# EAGLE design scheda_progetto_ver_4.2 (EAGLE 9.6.2)
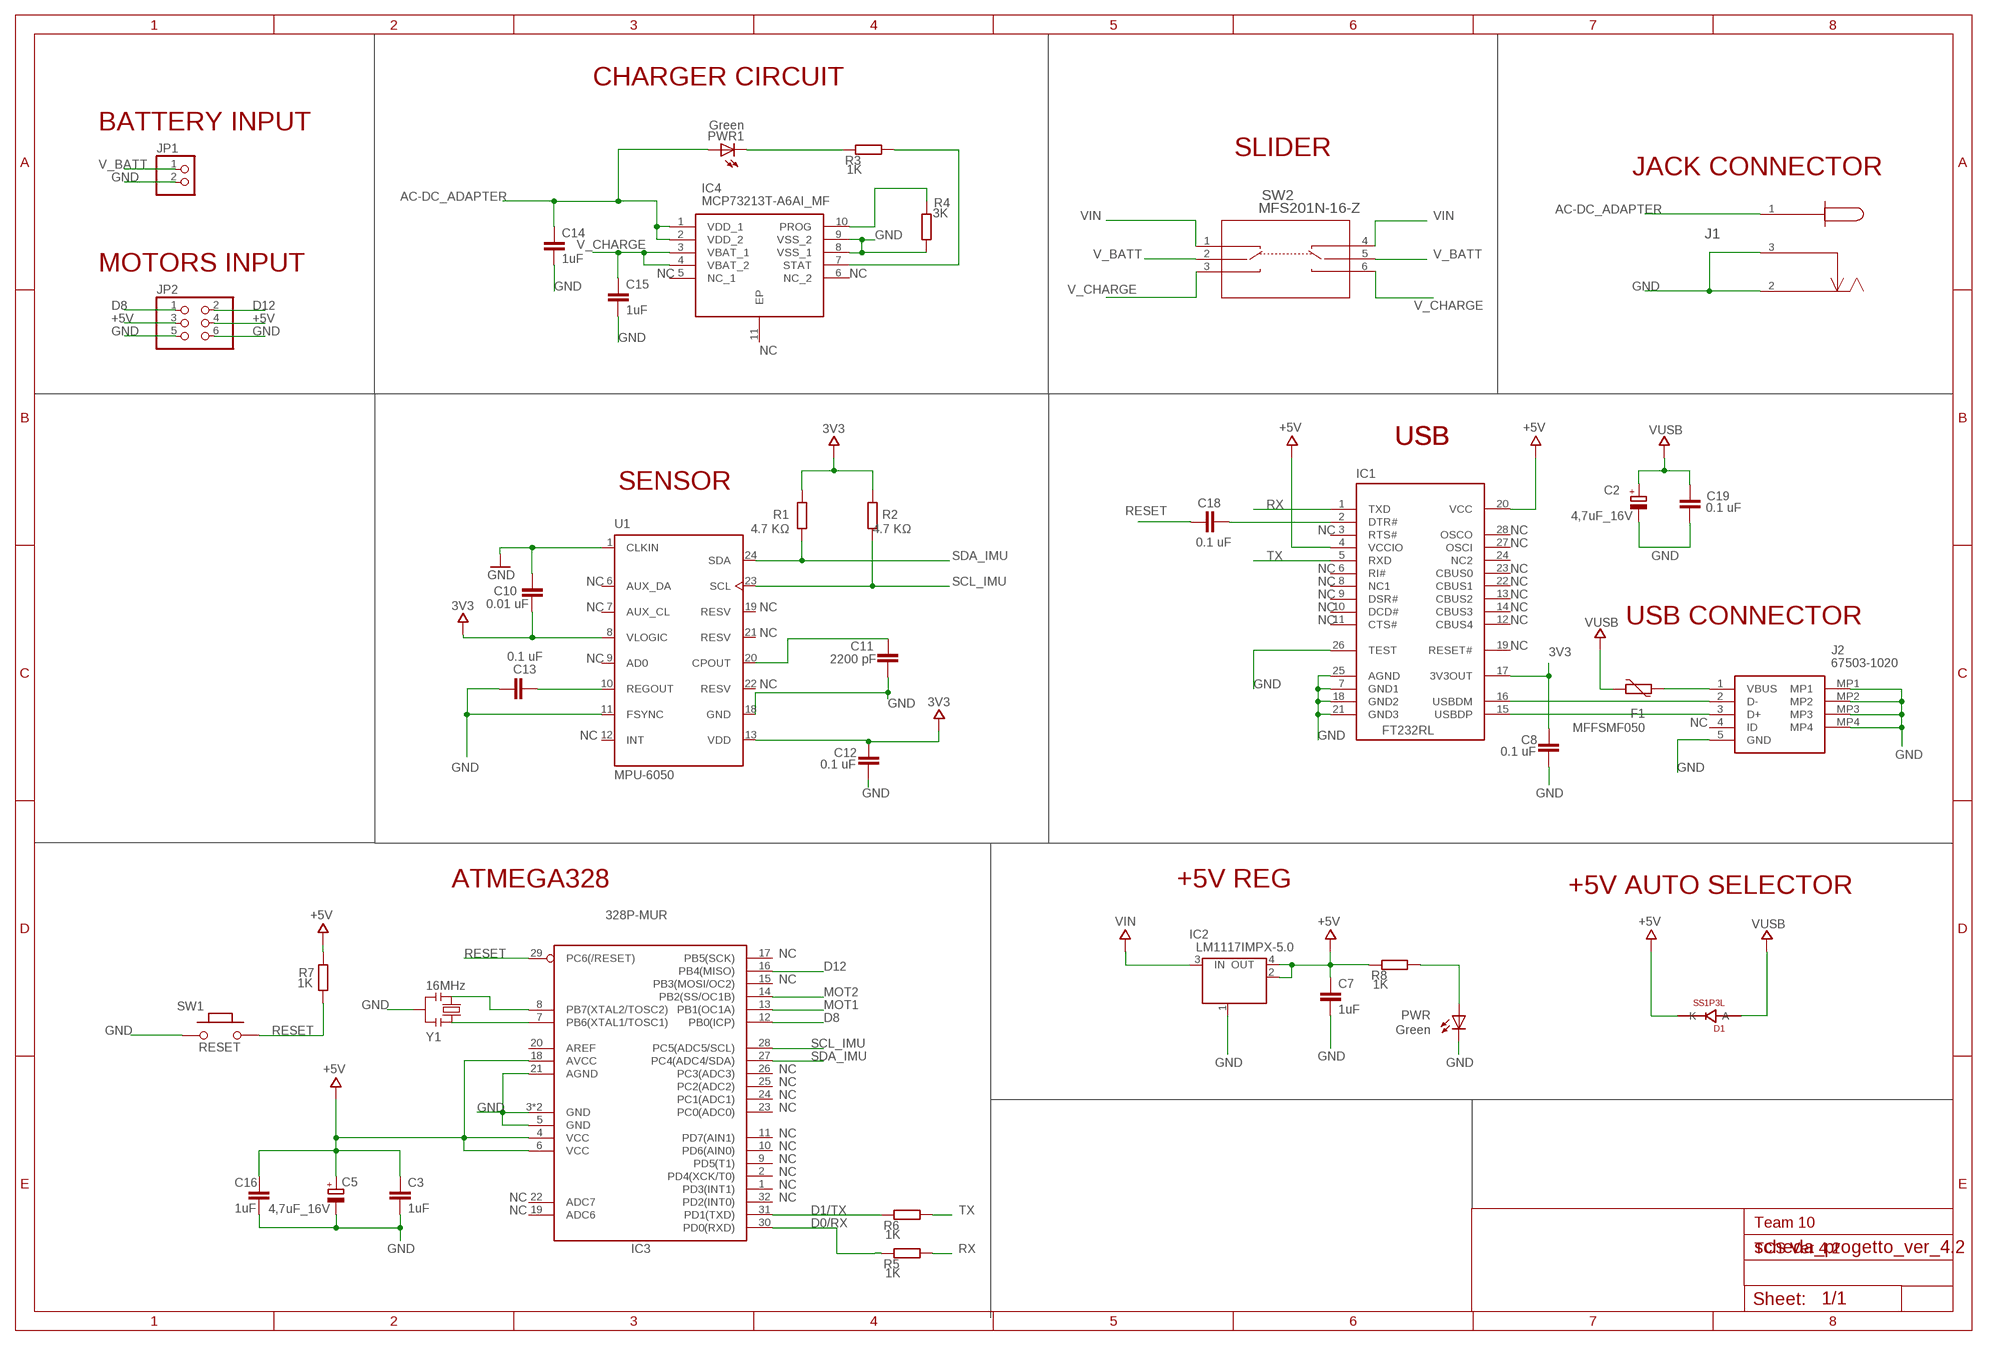
[diagram p0: schematic, sheet 1]

## Parts
C2  4,7uF_16V  0833_TAJA475MO16RNJ  [TAN-A]
C3  1uF  C-EUC0603  [C0603]
C5  4,7uF_16V  0833_TAJA475MO16RNJ  [TAN-A]
C7  1uF  C-EUC0603  [C0603]
C8  0.1 uF  C-EUC0603  [C0603]
C10  0.01 uF  C-EUC0603  [C0603]
C11  2200 pF  C-EUC0603  [C0603]
C12  0.1 uF  C-EUC0603  [C0603]
C13  0.1 uF  C-EUC0603  [C0603]
C14  1uF  C-EUC0603  [C0603]
C15  1uF  C-EUC0603  [C0603]
C16  1uF  C-EUC0603  [C0603]
C18  0.1 uF  C-EUC0603  [C0603]
C19  0.1 uF  C-EUC0603  [C0603]
D1  SS1P3L  0025_SS1P3L-M3/84A  [DO220AAL]
F1  MFFSMF050  PTC  [0603-1608X90N]
IC1  FT232RL  0226_FT232RL  [SSOP28]
IC2  LM1117IMPX-5.0  0022_LM1117IMPX-5.0  [LINEAR_SOT223]
IC3  328P-MUR  ATMEGA328P-32MUR  [VQFN32]
IC4  MCP73213T-A6AI_MF  [SON50P300X300X100-11N]
J1  694106105102  [CONN3_06105102_WRE]
J2  67503-1020  [675031020]
JP1  PINHD-1X2  [1X02]
JP2  PINHD-2X3  [2X03]
PWR  Green  0043_KPT-2012SGC  [CHIPLED_0805]
PWR1  Green  0043_KPT-2012SGC  [CHIPLED_0805]
R1  4.7 KΩ  R-EU_R0603  [R0603]
R2  4.7 KΩ  R-EU_R0603  [R0603]
R3  1K  R-EU_R0603  [R0603]
R4  3K  R-EU_R0603  [R0603]
R5  1K  R-EU_R0603  [R0603]
R6  1K  R-EU_R0603  [R0603]
R7  1K  R-EU_R0603  [R0603]
R8  1K  R-EU_R0603  [R0603]
SW1  RESET  0173_IT-1185AP1C-160G-G_T&R  [SMD_157SW]
SW2  MFS201N-16-Z  [MFS201N-16-Z_NDC]
U1  MPU-6050  [QFN50P400X400X95-24N]
Y1  16MHz  0011_CSTCE16M0V53-R0  [RESONATOR]

## Nets
3V3: C8.2 C10.1 C12.2 IC1.17(3V3OUT) R1.2 R2.2 U1.8(VLOGIC) U1.13(VDD)
+5V: C3.1 C5.1(+) C7.1 C16.1 D1.P$1(K) IC1.4(VCCIO) IC1.20(VCC) IC2.2(OUT) IC2.4(OUT) IC3.4(VCC) IC3.6(VCC) IC3.18(AVCC) JP2.3 JP2.4 R7.2 R8.1
AC-DC_ADAPTER: C14.1 IC4.1(VDD_1) IC4.2(VDD_2) J1.1 PWR1.A
D0/RX: IC3.30(PD0(RXD)) R5.1
D1/TX: IC3.31(PD1(TXD)) R6.1
D8: IC3.12(PB0(ICP)) JP2.1
D12: IC3.16(PB4(MISO)) JP2.2
GND: C2.2(-) C3.2 C5.2(-) C7.2 C8.1 C10.2 C11.1 C12.1 C13.2 C14.2 C15.2 C16.2 C19.1 IC1.7(GND1) IC1.18(GND2) IC1.21(GND3) IC1.25(AGND) IC1.26(TEST) IC2.1(GND/ADJ) IC3.3(GND) IC3.5(GND) IC3.21(AGND) IC3.33(GND) IC4.8(VSS_1) IC4.9(VSS_2) J1.2 J1.3 J2.5(GND) J2.MP1 J2.MP2 J2.MP3 J2.MP4 JP1.2 JP2.5 JP2.6 PWR.C R4.2 SW1.1 U1.1(CLKIN) U1.11(FSYNC) U1.18(GND) Y1.2
MOT1: IC3.13(PB1(OC1A))
MOT2: IC3.14(PB2(SS/OC1B))
N$1: IC3.8(PB7(XTAL2/TOSC2)) Y1.3
N$2: IC3.7(PB6(XTAL1/TOSC1)) Y1.1
N$3: PWR.A R8.2
N$4: C18.1 IC1.2(DTR#)
N$5: IC1.15(USBDP) J2.3(D+)
N$6: IC1.16(USBDM) J2.2(D-)
N$7: C11.2 U1.20(CPOUT)
N$8: IC4.10(PROG) R4.1
N$9: PWR1.C R3.1
N$10: IC4.7(STAT) R3.2
N$12: C13.1 U1.10(REGOUT)
N$19: F1.2 J2.1(VBUS)
RESET: C18.2 IC3.29(PC6(/RESET)) R7.1 SW1.2
RX: IC1.1(TXD) R5.2
SCL_IMU: IC3.28(PC5(ADC5/SCL)) R2.1 U1.23(SCL)
SDA_IMU: IC3.27(PC4(ADC4/SDA)) R1.1 U1.24(SDA)
TX: IC1.5(RXD) R6.2
V_BATT: JP1.1 SW2.2 SW2.5
V_CHARGE: C15.1 IC4.3(VBAT_1) IC4.4(VBAT_2) SW2.3 SW2.6
VIN: IC2.3(IN) SW2.1 SW2.4
VUSB: C2.1(+) C19.2 D1.P$2(A) F1.1
Unconnected: IC1.3(RTS#) IC1.6(RI#) IC1.8(NC1) IC1.9(DSR#) IC1.10(DCD#) IC1.11(CTS#) IC1.12(CBUS4) IC1.13(CBUS2) IC1.14(CBUS3) IC1.19(RESET#) IC1.22(CBUS1) IC1.23(CBUS0) IC1.24(NC2) IC1.27(OSCI) IC1.28(OSCO) IC3.1(PD3(INT1)) IC3.2(PD4(XCK/T0)) IC3.9(PD5(T1)) IC3.10(PD6(AIN0)) IC3.11(PD7(AIN1)) IC3.15(PB3(MOSI/OC2)) IC3.17(PB5(SCK)) IC3.19(ADC6) IC3.20(AREF) IC3.22(ADC7) IC3.23(PC0(ADC0)) IC3.24(PC1(ADC1)) IC3.25(PC2(ADC2)) IC3.26(PC3(ADC3)) IC3.32(PD2(INT0)) IC4.5(NC_1) IC4.6(NC_2) IC4.11(EP) J2.4(ID) U1.6(AUX_DA) U1.7(AUX_CL) U1.9(AD0) U1.12(INT) U1.19(RESV) U1.21(RESV) U1.22(RESV)

## Notes on the sheet
- CHARGER CIRCUIT
- BATTERY INPUT
- SLIDER
- JACK CONNECTOR
- MOTORS INPUT
- NC | NC
- NC
- USB | USB | USB
- SENSOR
- NC | NC
- NC
- NC | NC
- NC | NC | NC
- NC | NC
- NC | NC | NC | NC
- NC | NC | USB CONNECTOR
- NC
- NC
- NC
- NC
- NC
- NC
- ATMEGA328 | +5V REG | +5V AUTO SELECTOR
- NC
- NC
- NC
- NC
- NC
- NC
- NC
- NC
- NC
- NC
- NC
- NC | NC
- NC
- Team 10
- TCS Ver 4.2

## Library data of the parts
C2 C5 = Condensatori:0833_TAJA475MO16RNJ: 4,7uF; CASE: Case_A_(1206); MF: KYOCERA AVX; MONTHLY_USAGE: _____; MPN: TAJA475M016RNJ; OC_FARNELL: 2333019; PART_NUMBER: TAJA475MO16RNJ; PRICE: _____; SUPPLIER: _____; TYPE: Condensatori
C3 C7 C14-C16 = rcl:C-EU: CAPACITOR, European symbol; MF: KYOCERA AVX; MPN: 0603YC105KAT4A; OC_FARNELL: 3340859; SPICEPREFIX: C
C8 C12 C13 C18 C19 = rcl:C-EU: CAPACITOR, European symbol; MF: KEMET; MPN: C0603C104K3RECTU; OC_FARNELL: 2904649; SPICEPREFIX: C
C10 = rcl:C-EU: CAPACITOR, European symbol; MF: MURATA; MPN: GRM1885C1H103JA01D; OC_FARNELL: 2456107; SPICEPREFIX: C
C11 = rcl:C-EU: CAPACITOR, European symbol; MF: WURTH ELEKTRONIK; MPN: 885012206061; OC_FARNELL: 2534028; SPICEPREFIX: C
D1 = Diodi:0025_SS1P3L-M3/84A: 1A 30V Schottky Barrier Rectifiers -SS1P3L-M3/84A; CASE: SMP; MF: VISHAY; MONTHLY_USAGE: _____; MPN: SS1P3L-M3/84A; OC_FARNELL: 2889242; PART_NUMBER: SS1P3L-M3/84A; PRICE: _____; SUPPLIER: _____; TYPE: Diodi
F1 = Arduino-rcl:PTC: SMD PTC; DATASHEET: http://www.bourns.com/docs/Product-Datasheets/mffsmf.pdf; DISTRIBUTOR-LINK: http://www.digikey.com/product-detail/en/bourns-inc/MF-FSMF050X-2/MF-FSMF050X-2CT-ND/2039389; DISTRIBUTOR-PN: MF-FSMF050X-2CT-ND; MANUFACTURER: Bourns Inc; MANUFACTURER-PN: MF-FSMF050X-2; MF: BOURNS; MPN: MF-FSMF050X-2; OC_FARNELL: 1717227
IC1 = IntegratedCircuits:0226_FT232RL: USB to serial UART interface -FT232RL; CASE: SSOP28; MONTHLY_USAGE: _____; OC_FARNELL: unknown; PART_NUMBER: FT232RL; PRICE: _____; SUPPLIER: _____; TYPE: Circuito_Integrato
IC2 = IntegratedCircuits:0022_LM1117IMPX-5.0: Low-dropout linear regulator 5V -LM1117IMPX-5.0; CASE: SOT223; MONTHLY_USAGE: _____; OC_FARNELL: unknown; PART_NUMBER: LM1117IMPX-5.0; PRICE: _____; SUPPLIER: _____; TYPE: Circuito_Integrato
IC3 = Arduino-ucs&SoCs:ATMEGA328P-32: 8-bit Microcontroller with 32KBytes In-System Programmable Flash ATMEGA328P-AU; DATASHEET: http://www.atmel.com/images/Atmel-8271-8-bit-AVR-Microcontroller-ATmega48A-48PA-88A-88PA-168A-168PA-328-328P_datasheet_Complete.pdf; DISTRIBUTOR-LINK: https://www.digikey.it/product-detail/it/microchip-technology/ATMEGA328P-MUR/ATMEGA328P-MURCT-ND/3440953; DISTRIBUTOR-PN: ATMEGA328P-MURCT-ND; MANUFACTURER: ATMEL; MANUFACTURER-PN: ATMEGA328P-MUR; MF: MICROCHIP; MPN: ATMEGA328P-MUR; OC_FARNELL: 2425125
IC4 = MCP73213T-A6AI_MF:MCP73213T-A6AI_MF: Battery Management OVP BATTERY CHARGER DUAL CELL Source: Datasheet <https://ww1.microchip.com/downloads/aemDocuments/documents/OTH/ProductDocuments/DataSheets/20002190D.pdf>; DESCRIPTION: Battery Management OVP BATTERY CHARGER DUAL CELL; HEIGHT: 1mm; MANUFACTURER_NAME: Microchip; MANUFACTURER_PART_NUMBER: MCP73213T-A6AI/MF; MOUSER_PART_NUMBER: 579-MCP73213TA6AIMF; MOUSER_PRICE-STOCK: https://www.mouser.co.uk/ProductDetail/Microchip-Technology/MCP73213T-A6AI-MF?qs=j%252B1pi9TdxUb%252BaD3nV7e9gA%3D%3D; OC_FARNELL: unknown
J1 = jack_2_pin:694106105102; COPYRIGHT: Copyright (C) 2023 Ultra Librarian. All rights reserved.; MANUFACTURER_PART_NUMBER: 694106105102; MF: WURTH ELEKTRONIK; MFR_NAME: Wurth Electronics; MPN: 694106105102; OC_FARNELL: 2472147
J2 = 67503-1020:67503-1020: USB Connectors USB Mini-B Recept On-The-Go Rt.Angle Source: Datasheet <https://www.molex.com/pdm_docs/sd/675031020_sd.pdf>; DESCRIPTION: USB Connectors USB Mini-B Recept On-The-Go Rt.Angle; HEIGHT: 4.05mm; MANUFACTURER_NAME: Molex; MANUFACTURER_PART_NUMBER: 67503-1020; MF: MOLEX; MOUSER_PART_NUMBER: 538-67503-1020; MOUSER_PRICE-STOCK: https://www.mouser.co.uk/ProductDetail/Molex/67503-1020?qs=7zcQ9RRVJlhHWuXYKEhKMg%3D%3D; MPN: 67503-1020...; OC_FARNELL: 1125348
JP1 = pinhead:PINHD-1X2: PIN HEADER; MF: AMP - TE CONNECTIVITY; MPN: 171826-2; OC_FARNELL: 3398291
JP2 = pinhead:PINHD-2X3: PIN HEADER; MF: MOLEX; MPN: 87911-0611; OC_FARNELL: 3049596
PWR PWR1 = Opto:0043_KPT-2012SGC: LED GREEN - SMD-0805; MF: KINGBRIGHT; MONTHLY_USAGE: _____; MPN: KPT-2012SGC; OC_FARNELL: 2099239; PART_NUMBER: KPT-2012SGC; PRICE: _____; SUPPLIER: _____; TYPE: Opto
R1 R2 = rcl:R-EU_: RESISTOR, European symbol; MF: YAGEO; MPN: AC0603JR-074K7L; OC_FARNELL: 3495312; SPICEPREFIX: R
R3 R5-R8 = rcl:R-EU_: RESISTOR, European symbol; MF: BOURNS; MPN: CAY16-102J4LF; OC_FARNELL: 1770133; SPICEPREFIX: R
R4 = rcl:R-EU_: RESISTOR, European symbol; MF: BOURNS; MPN: CR0603-JW-302ELF; OC_FARNELL: 2908368; SPICEPREFIX: R
SW1 = Switches:0173_IT-1185AP1C-160G-G_T&R: Pushbutton 4x3 SMD H2,5mm; MF: MULTICOMP PRO; MONTHLY_USAGE: _____; MPN: R13-24AL-05-BB; OC_FARNELL: 1634693; PART_NUMBER: IT-1185AP1C-160G-G_T&R; PRICE: _____; SUPPLIER: _____; TYPE: Switches; VALUE: 157SW
SW2 = switch_a_slitta:MFS201N-16-Z; COPYRIGHT: Copyright (C) 2023 Ultra Librarian. All rights reserved.; MANUFACTURER_PART_NUMBER: MFS201N-16-Z; MF: NIDEC COMPONENTS; MFR_NAME: Nidec Copal Electronics; MPN: MFS201N-16-Z; OC_FARNELL: 2854845
U1 = MPU-6050 (1):MPU-6050: MPU-6050 Six-Axis (Gyro + Accelerometer) MEMS MotionTracking™ Devices Check prices <https://pricing.snapeda.com/parts/MPU-6050/TDK%20InvenSense/view-part?ref=eda>; AVAILABILITY: In Stock; DESCRIPTION: Accelerometer, Gyroscope, 6 Axis Sensor I²C Output; MF: TDK INVENSENSE; MP: MPU-6050; MPN: MPU-6050; OC_FARNELL: 1864742; PACKAGE: VFQFN-24 TDK InvenSense; PRICE: None; PURCHASE-URL: https://pricing.snapeda.com/search/part/MPU-6050/?ref=eda
Y1 = Cristalli:0011_CSTCE16M0V53-R0: 16Mhz - SMD; MONTHLY_USAGE: _____; OC_FARNELL: unknown; PART_NUMBER: CSTCE16M0V53-R0; PRICE: _____; SUPPLIER: _____; TYPE: Cristalli; VALUE: CSTCE16M0V53-R0

## Board
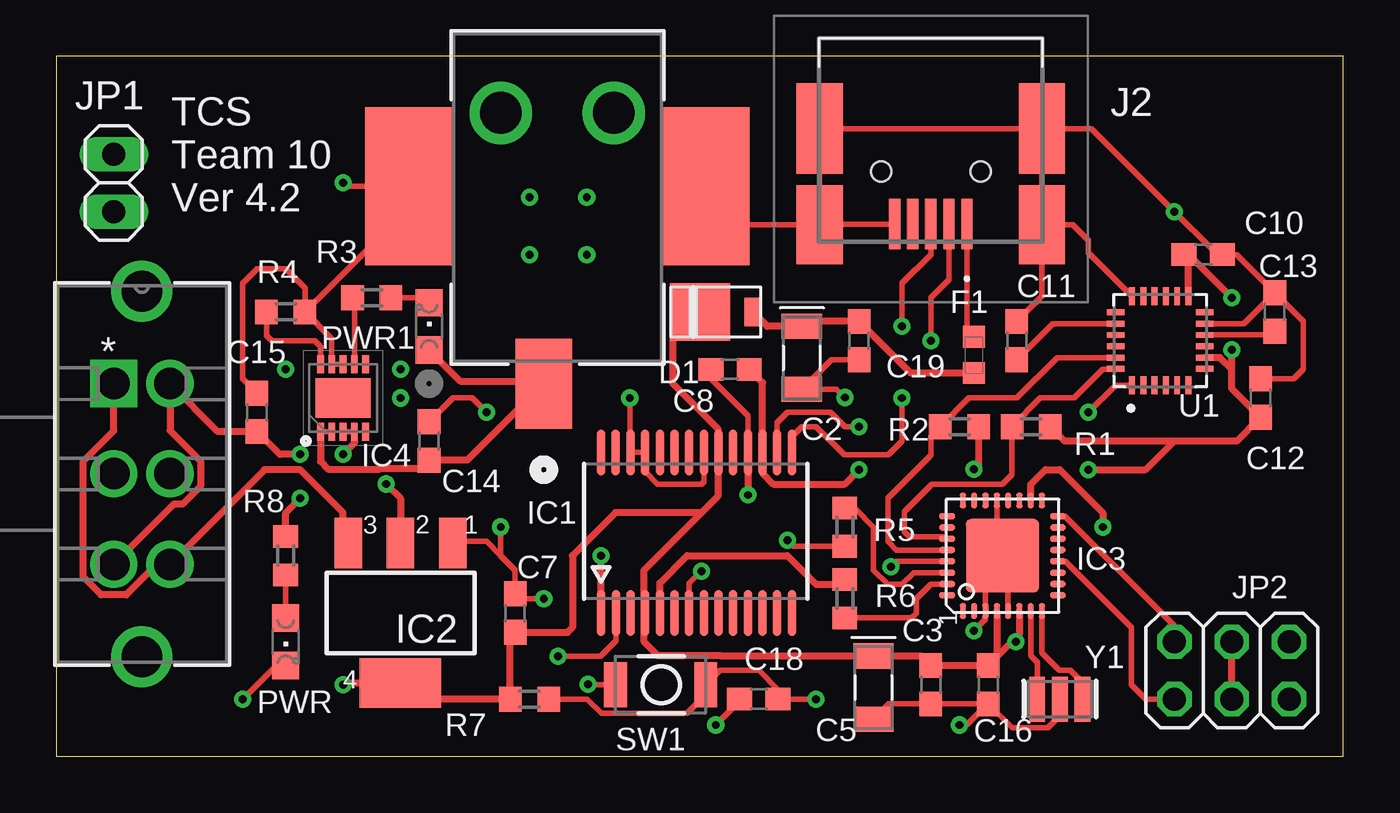
[diagram p1: board, top side]
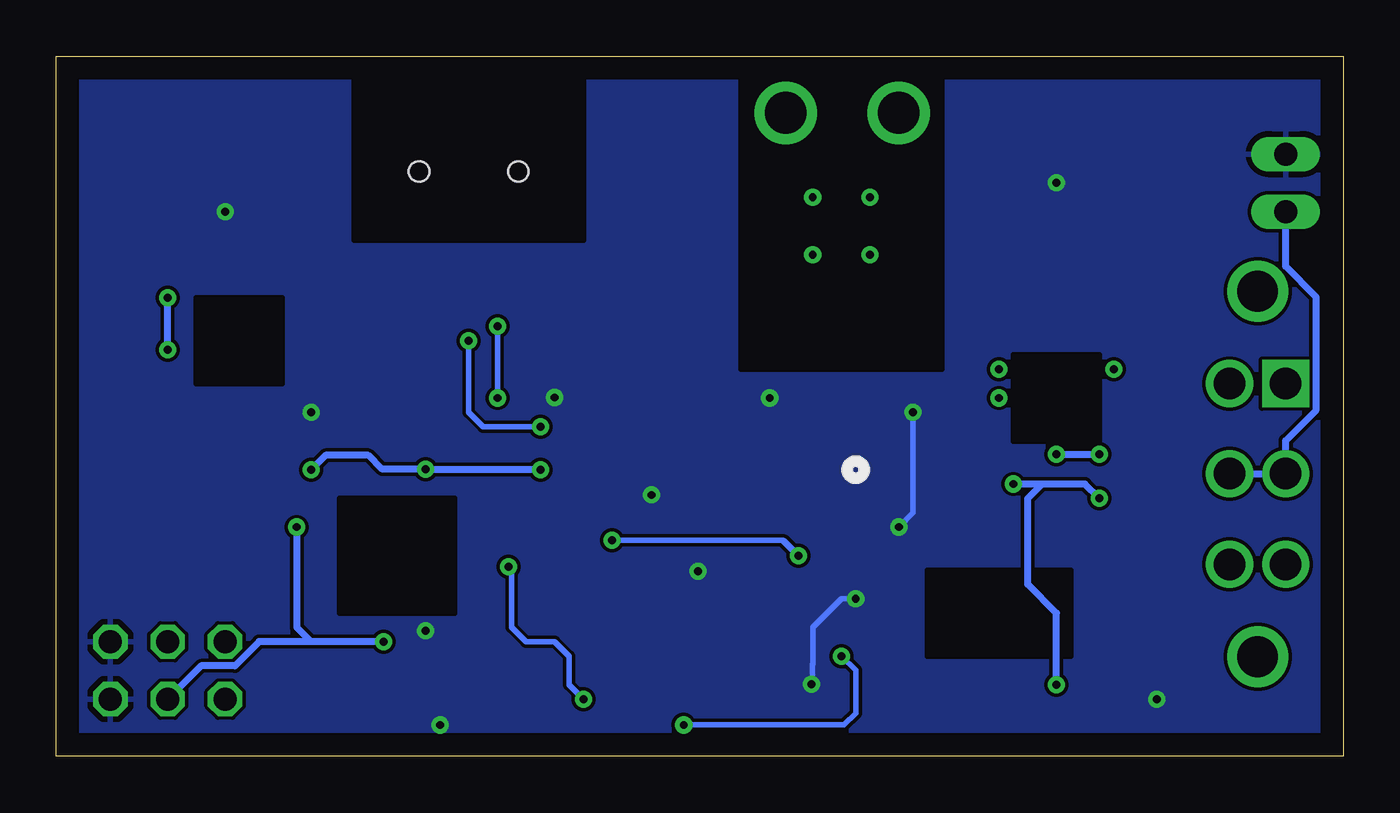
[diagram p2: board, bottom side, seen from below]

Size 57 x 31 mm. Coordinates in mm from the lower left corner, seen from the top.
Outline: 0,0 57,0 57,31 0,31 0,0
Copper layers (1*16): Top 0.035mm / dielectric 1.5mm / Bottom 0.035mm
Design rules "default": minimum track width 6mil, minimum drill 0.35mm, track to track 6mil, track to pad 6mil, pad to pad 6mil, via to via 6mil, smd to smd 6mil, copper to edge 40mil, drill to drill 6mil, minimum pad ring 10mil, minimum via ring 8mil, stop-mask expansion 4mil, vias tented up to drill 0mil, thermal gap 10mil
tKeepout: area 17.8,17.8 to 26.7,31.1; area 12.1,4.4 to 18.4,8.3; area 47,16.5 to 50.8,20.3

### Footprints (pad centres in the part's own frame; a part is rotated, then mirrored left to right if it is on the bottom)
TAN-A = smd 1.118 x 1.778: 1 0,0; 2 2.794,0
C0603 = smd 1.1 x 1: 1 -0.85,0; 2 0.85,0
DO220AAL = smd 2.667 x 2.54: P$1 -0.7,0 | smd 0.762 x 1.27: P$2 1.65,0
0603-1608X90N = smd 0.95 x 1: 1 -0.8,0; 2 0.8,0
SSOP28 = smd 0.381 x 2.032: 1 0,0; 2 0.65,0; 3 1.3,0; 4 1.95,0; 5 2.6,0; 6 3.25,0; 7 3.9,0; 8 4.55,0; 9 5.2,0; 10 5.85,0; 11 6.5,0; 12 7.15,0; 13 7.8,0; 14 8.45,0; 15 8.45,7.112; 16 7.8,7.112; 17 7.15,7.112; 18 6.5,7.112; 19 5.85,7.112; 20 5.2,7.112; 21 4.55,7.112; 22 3.9,7.112; 23 3.25,7.112; 24 2.6,7.112; 25 1.95,7.112; 26 1.3,7.112; 27 0.65,7.112; 28 0,7.112
LINEAR_SOT223 = smd 1.219 x 2.235: 1 -2.311,-3.099; 2 0,-3.099; 3 2.311,-3.099 | smd 3.6 x 2.2: 4 0,3.099
VQFN32 = smd 0.7 x 0.28: 1 -2.45,1.75; 2 -2.45,1.25; 3 -2.45,0.75; 4 -2.45,0.25; 5 -2.45,-0.25; 6 -2.45,-0.75; 7 -2.45,-1.25; 8 -2.45,-1.75; 17 2.45,-1.75; 18 2.45,-1.25; 19 2.45,-0.75; 20 2.45,-0.25; 21 2.45,0.25; 22 2.45,0.75; 23 2.45,1.25; 24 2.45,1.75 | smd 0.28 x 0.7: 9 -1.75,-2.45; 10 -1.25,-2.45; 11 -0.75,-2.45; 12 -0.25,-2.45; 13 0.25,-2.45; 14 0.75,-2.45; 15 1.25,-2.45; 16 1.75,-2.45; 25 1.75,2.45; 26 1.25,2.45; 27 0.75,2.45; 28 0.25,2.45; 29 -0.25,2.45; 30 -0.75,2.45; 31 -1.25,2.45; 32 -1.75,2.45 | smd 3.254 x 3.254: 33 0,0
SON50P300X300X100-11N = smd 0.8 x 0.3: 1 -1.5,1; 2 -1.5,0.5; 3 -1.5,0; 4 -1.5,-0.5; 5 -1.5,-1; 6 1.5,-1; 7 1.5,-0.5; 8 1.5,0; 9 1.5,0.5; 10 1.5,1 | smd 1.75 x 2.45: 11 0,0
CONN3_06105102_WRE = smd 3.988 x 2.489: 1 0,0 | smd 7.01 x 3.912: 2 -8.739,7.15; 3 -8.739,-5.95 | drill 1.854 pad 2.362: 4 -11.989,3.099; 5 -11.989,-1.905
675031020 = smd 0.5 x 2.25: 1 -1.6,3.725; 2 -0.8,3.725; 3 0,3.725; 4 0.8,3.725; 5 1.6,3.725 | smd 2.05 x 3.5: MP1 -4.925,3.75; MP2 4.925,3.75 | smd 2.05 x 4: MP3 -4.925,-0.5; MP4 4.925,-0.5 | hole 0.9: -2.2,1.4; 2.2,1.4
1X02 = drill 1.016 long: 1 -1.27,0; 2 1.27,0
2X03 = drill 1.016 octagon: 1 -2.54,-1.27; 2 -2.54,1.27; 3 0,-1.27; 4 0,1.27; 5 2.54,-1.27; 6 2.54,1.27
CHIPLED_0805 = smd 1.2 x 1.2: A 0,-1.05; C 0,1.05
R0603 = smd 1 x 1.1: 1 -0.85,0; 2 0.85,0
SMD_157SW = smd 1.016 x 1.981: 1 0,0; 2 4,0
MFS201N-16-Z_NDC = drill 1.397 pad 1.905 square: 1 0,0 | drill 1.397 pad 1.905: 2 0,-3.988; 3 0,-8.001; 4 2.489,-8.001; 5 2.489,-3.988; 6 2.489,0 | drill 1.803 pad 2.311: 7 1.245,4.089; 8 1.245,-12.09
QFN50P400X400X95-24N = smd 0.79 x 0.26: 1 -1.97,1.25; 2 -1.97,0.75; 3 -1.97,0.25; 4 -1.97,-0.25; 5 -1.97,-0.75; 6 -1.97,-1.25; 13 1.97,-1.25; 14 1.97,-0.75; 15 1.97,-0.25; 16 1.97,0.25; 17 1.97,0.75; 18 1.97,1.25 | smd 0.26 x 0.79: 7 -1.25,-1.97; 8 -0.75,-1.97; 9 -0.25,-1.97; 10 0.25,-1.97; 11 0.75,-1.97; 12 1.25,-1.97; 19 1.25,1.97; 20 0.75,1.97; 21 0.25,1.97; 22 -0.25,1.97; 23 -0.75,1.97; 24 -1.25,1.97
RESONATOR = smd 0.7 x 2: 1 -1,0; 2 0,0; 3 1,0

### Placement (x,y rotation side)
C2  33.02,19.05 270 top
C3  38.73,3.17 270 top
C5  36.2,4.45 270 top
C7  20.32,6.35 90 top
C8  29.84,17.14 0 top
C10  50.8,22.23 0 top
C11  42.55,18.41 270 top
C12  53.34,15.88 270 top
C13  53.98,19.68 90 top
C14  16.51,13.97 90 top
C15  8.89,15.24 90 top
C16  41.27,3.17 270 top
C18  31.11,2.54 0 top
C19  35.56,18.41 90 top
D1  29.21,19.68 0 top
F1  40.64,17.78 90 top
IC1  24.13,6.35 0 top
IC2  15.24,6.35 180 top
IC3  41.91,8.89 90 top
IC4  12.7,15.88 90 top
J1  21.59,16.51 270 top
J2  38.73,27.3 180 top
JP1  2.54,25.4 90 top
JP2  52.07,3.81 0 top
PWR  10.16,5.08 180 top
PWR1  16.51,19.05 0 top
R1  43.18,14.61 0 top
R2  40.01,14.61 0 top
R3  13.97,20.32 180 top
R4  10.16,19.68 0 top
R5  34.92,10.16 270 top
R6  34.92,6.99 90 top
R7  20.95,2.54 180 top
R8  10.16,8.89 270 top
SW1  24.77,3.17 0 top
SW2  2.54,16.51 0 top
U1  48.9,18.41 90 top
Y1  44.45,2.54 0 top

### Tracks (layer width: path | path; a pad name or v marks a point on that pad's centre or on a via)
3V3  (via drill 0.35)
  Top 0.305: C8.2 31.28,16.56 IC1.17 31.28,12.54 31.75,12.06 34.92,12.06 v35.56,12.7 | v40.64,12.72 40.85,12.94 R2.2 | 49.53,13.97 52.28,13.97 C12.2 52.07,16.3 52.07,17.14 | 49.53,13.97 44.66,13.97 R1.2 | U1.13 50.15,22.03 | 50.15,22.03 C10.1 | 52.07,17.14 51.55,17.66 U1.8 | 52.07,17.14 v52.07,18.01 | 50.15,22.03 50.36,22.03 v52.07,20.32 | v45.72,12.7 48.26,12.7 49.53,13.97
  Bottom 0.305: v35.56,12.7 40.64,12.7 v40.64,12.72 42.57,12.72 43.18,13.34 45.09,13.34 v45.72,12.7 | v52.07,18.01 v52.07,20.32
+5V  (via drill 0.35)
  Top 0.305: IC1.4 26.04,6.39 | 26.04,6.39 26.04,8.26 28.57,10.79 | 28.57,10.79 29.33,11.55 IC1.20 29.33,14.48 27.3,16.51 27.3,18.48 D1.P$1 | C16.1 C3.1 38.31,4.45 C5.1 29.43,4.45 29.4,4.47 26.64,4.47 26.04,5.08 26.04,6.39 | IC3.4 41.66,4.41 C16.1 | R8.1 10.16,10.79 v10.79,11.43 | v14.61,12.06 15.24,11.43 IC2.2 | 28.57,10.79 24.77,10.79 22.86,8.89 22.86,5.71 22.64,5.5 C7.1 20.11,5.29 R7.2 15.95,2.54 IC2.4 12.78,3.25 v12.7,3.17 | JP2.3 JP2.4 | IC3.18 43.16,12.04 43.81,12.7 44.45,12.7 46.35,10.79 v46.35,10.16 | C16.1 42.33,5.08 | 42.33,5.08 v42.5,5.08 | IC3.6 42.66,5.41 42.33,5.08
  Bottom 0.305: v10.79,11.43 11.43,12.06 13.34,12.06 | 13.34,12.06 v14.61,12.06 | v42.5,5.08 45.72,5.08 | 45.72,5.08 48.02,5.08 49.09,4.01 50.6,4.01 JP2.3 | v46.35,10.16 46.35,5.71 45.72,5.08 | v12.7,3.17 12.7,6.35 13.97,7.62 13.97,11.43 13.34,12.06
AC-DC_ADAPTER
  Top 0.254: IC4.2 IC4.1
  Top 0.305: IC4.1 11.7,13.06 12.06,12.7 14.27,12.7 14.32,12.75 16.14,12.75 C14.1 18.2,13.12 J1.1 21.48,16.62 17.89,16.62 PWR1.A
D0/RX
  Top 0.254: R5.1 35.34,11.01 36.2,10.16 36.2,8.26 36.83,7.62 37.47,7.62 37.98,8.14 IC3.30
D1/TX
  Top 0.254: R6.1 35.56,6.13 35.98,6.13 37.88,6.13 38.1,6.35 38.1,6.99 38.73,7.62 39.44,7.62 IC3.31
D8
  Top 0.254: IC3.12 44.7,8.64 47.62,5.71 47.62,3.17 48.26,2.54 JP2.1
D12
  Top 0.254: IC3.16 44.68,10.64 49.53,5.79 JP2.2
GND  (via drill 0.35)
  Top 0.254: C16.2 C3.2 36.87,2.33 C5.2 | C16.2 42.34,1.26 43.92,1.26 44.45,1.79 Y1.2 | R4.2 12.2,18.5 IC4.9 IC4.8 | PWR.C 9.74,4.03 v8.26,2.54 | 19.68,8.89 20.32,8.26 C7.2 20.54,6.99 v21.59,6.99 | 19.68,8.89 19.05,9.53 17.63,9.53 IC2.1 | 19.68,8.89 v19.68,10.16 | C15.2 8.26,16.73 8.26,20.95 8.89,21.59 10.16,21.59 11.01,20.74 R4.2 | v40.64,5.56 41.16,6.08 IC3.3 41.16,8.14 41.66,8.64 | IC1.18 30.63,15.09 29,16.73 C8.1 | SW1.1 23.57,3.17 v23.54,3.2 | IC1.7 28.03,7.66 v28.57,8.21 | R4.2 15.64,24.32 J1.3 12.85,25.25 v12.7,25.4 | 41.66,8.64 IC3.33 42.16,8.64 IC3.5 | IC3.21 41.66,8.64 | C16.2 40.34,1.39 v40.01,1.39 | U1.11 52.6,19.16 C13.2 | C13.2 52.28,22.23 C10.2 51.87,22.01 51.22,22.44 v49.53,24.13 45.85,27.8 J2.MP3 | U1.1 46.92,16.45 v45.72,15.24 | IC1.21 28.68,12.17 28.57,12.06 26.64,12.06 26.08,12.62 IC1.25 IC1.26 25.4,13.49 v25.4,15.88 | C19.1 34.33,17.57 C2.2 34.57,16.26 v34.92,15.9 | v19.05,15.24 18.41,15.88 17.57,15.88 C14.2 | J2.5 33.84,23.58 J2.MP2 | J2.MP2 30.43,23.55 J1.2 | J2.MP2 J2.MP4 J2.MP3 | U1.18 45.72,22.31 45.72,22.86 45.02,23.55 J2.MP1 | J2.MP1 J2.MP3 | C11.1 43.66,20.38 J2.MP1 | C12.1 54.83,16.73 55.24,17.14 55.24,19.27 C13.2
  Top 0.305: IC1.18 v30.63,11.58
  Bottom 0.254: v19.68,10.16 19.05,10.79 v19.05,15.24 | v23.54,3.2 23.52,3.22 23.52,4.08 23.5,4.11 23.5,5.71 22.23,6.99 v21.59,6.99
  pour Bottom: 0,31.11 0,0 57.15,0 57.15,31.11
  cutout Bottom: 10.79,17.78 10.79,13.97 13.97,13.97 14.61,13.97 14.61,17.78
  cutout Bottom: 12.06,8.26 12.06,4.45 18.41,4.45 18.41,8.26
  cutout Bottom: 39.37,11.43 39.37,6.35 44.45,6.35 44.45,11.43
  cutout Bottom: 46.99,20.32 46.99,16.51 50.8,16.51 50.8,20.32
  cutout Bottom: 33.66,31.11 33.66,22.86 43.81,22.86 43.81,31.11
  cutout Bottom: 17.78,29.84 17.78,17.14 26.67,17.14 26.67,29.84
N$1
  Top 0.254: Y1.3 45.45,3.29 44.92,3.82 44.44,3.82 43.66,4.6 IC3.8
N$2
  Top 0.254: Y1.1 43.45,4.17 43.16,4.46 IC3.7
N$3
  Top 0.254: PWR.A R8.2
N$4  (via drill 0.35)
  Top 0.254: C18.1 30.27,2.45 v29.21,1.39 | IC1.2 24.78,5.12 24.11,4.45 v22.23,4.45
  Bottom 0.254: v29.21,1.39 23.5,1.39 23.37,1.39 22.1,1.39 21.59,1.91 21.59,3.81 v22.23,4.45
N$5  (via drill 0.35)
  Top 0.254: IC1.15 32.58,14.16 33.02,14.61 33.66,14.61 34.9,13.36 36.85,13.36 37.47,13.97 v37.47,15.88 | v37.47,19.05 37.47,20.95 38.73,22.23 J2.3
  Bottom 0.254: v37.47,15.88 v37.47,19.05
N$6  (via drill 0.35)
  Top 0.254: IC1.16 31.93,14.79 32.38,15.24 34.29,15.24 34.92,14.61 v35.56,14.61 | J2.2 39.53,21.12 38.73,20.32 v38.73,18.41
  Bottom 0.254: v38.73,18.41 38.73,15.24 38.1,14.61 v35.56,14.61
N$7
  Top 0.254: U1.20 44.15,19.16 C11.2
N$8
  Top 0.254: IC4.10 11.7,18.14 11.43,18.41 9.53,18.41 9.31,18.63 R4.1
N$9
  Top 0.254: PWR1.C 16.29,20.32 R3.1
N$10
  Top 0.254: IC4.7 13.2,20.24 R3.2
N$11  (via drill 0.35)
  other vias: 20.95,24.77
N$12
  Top 0.254: U1.10 53.8,18.66 C13.1
N$13  (via drill 0.35)
  other vias: 23.5,24.77
N$14  (via drill 0.35)
  other vias: 20.95,22.23
N$15  (via drill 0.35)
  other vias: 23.5,22.23
N$16  (via drill 0.35)
  other vias: 15.24,17.14
N$17  (via drill 0.35)
  other vias: 15.24,15.88
N$18  (via drill 0.35)
  other vias: 10.16,17.14
N$19
  Top 0.254: F1.2 40.34,18.89 J2.1
RESET  (via drill 0.35)
  Top 0.254: IC3.29 37.22,8.64 v36.98,8.4 | R7.1 23.51,2.54 24.14,1.91 27.94,1.91 28.77,2.73 SW1.2 29.4,3.81 31.11,3.81 31.96,2.96 C18.2 v33.66,2.54
  Bottom 0.254: v36.98,8.4 36.83,8.26 36.83,5.71 36.2,5.08 34.92,5.08 34.29,4.45 34.29,3.17 v33.66,2.54
RX  (via drill 0.35)
  Top 0.254: v32.38,9.57 32.65,9.31 R5.2
  Top 0.305: IC1.1 v24.13,8.89
  Bottom 0.254: 24.77,9.53 24.81,9.57 v32.38,9.57
  Bottom 0.305: v24.13,8.89 24.77,9.53
SCL_IMU
  Top 0.254: IC3.28 37.22,9.14 36.83,9.53 36.83,11.43 38.73,13.34 38.73,14.19 R2.1 40.42,15.88 42.55,15.88 44.34,17.66 U1.23
SDA_IMU
  Top 0.254: IC3.27 39.38,9.72 37.79,9.72 37.56,9.95 37.56,10.83 38.8,12.06 41.91,12.06 42.33,12.48 R1.1 43.6,15.88 45.09,15.88 46.35,17.14 46.91,17.14 U1.24
TX
  Top 0.305: IC1.5 26.73,7.68 27.94,8.89 32.38,8.89 33.66,7.62 34.71,7.62 R6.2
V_BATT
  Bottom 0.305: SW2.5 SW2.2 2.54,13.98 1.19,15.34 1.19,20.35 2.54,21.7 JP1.1
V_CHARGE  (via drill 0.35)
  Top 0.254: IC4.3 IC4.4 13.2,13.97
  Top 0.305: SW2.3 5.2,11.17 5.59,11.17 6.38,11.96 6.38,13.08 5.03,14.44 SW2.6 7.15,14.39 C15.1 9.9,13.38 v10.79,13.38 | 13.2,13.97 13.2,13.88 v12.7,13.38
  Bottom 0.305: v12.7,13.38 v10.79,13.38
VIN
  Top 0.305: SW2.1 2.54,14.44 1.19,13.08 1.19,7.95 1.98,7.16 3.1,7.16 4.45,8.51 SW2.4 9.22,12.7 10.79,12.7 12.7,10.79 12.7,9.68 IC2.3
VUSB
  Top 0.305: D1.P$2 31.5,19.05 C2.1 33.23,19.27 C19.2 37.84,16.98 F1.1

### Text on the board
tNames: TCS / Team 10 / Ver 4.2